# Altium schematic sheet Clock_WR.SchDoc
size A3; DocumentNumber: 24; SheetNumber: 24; SheetTotal: 30
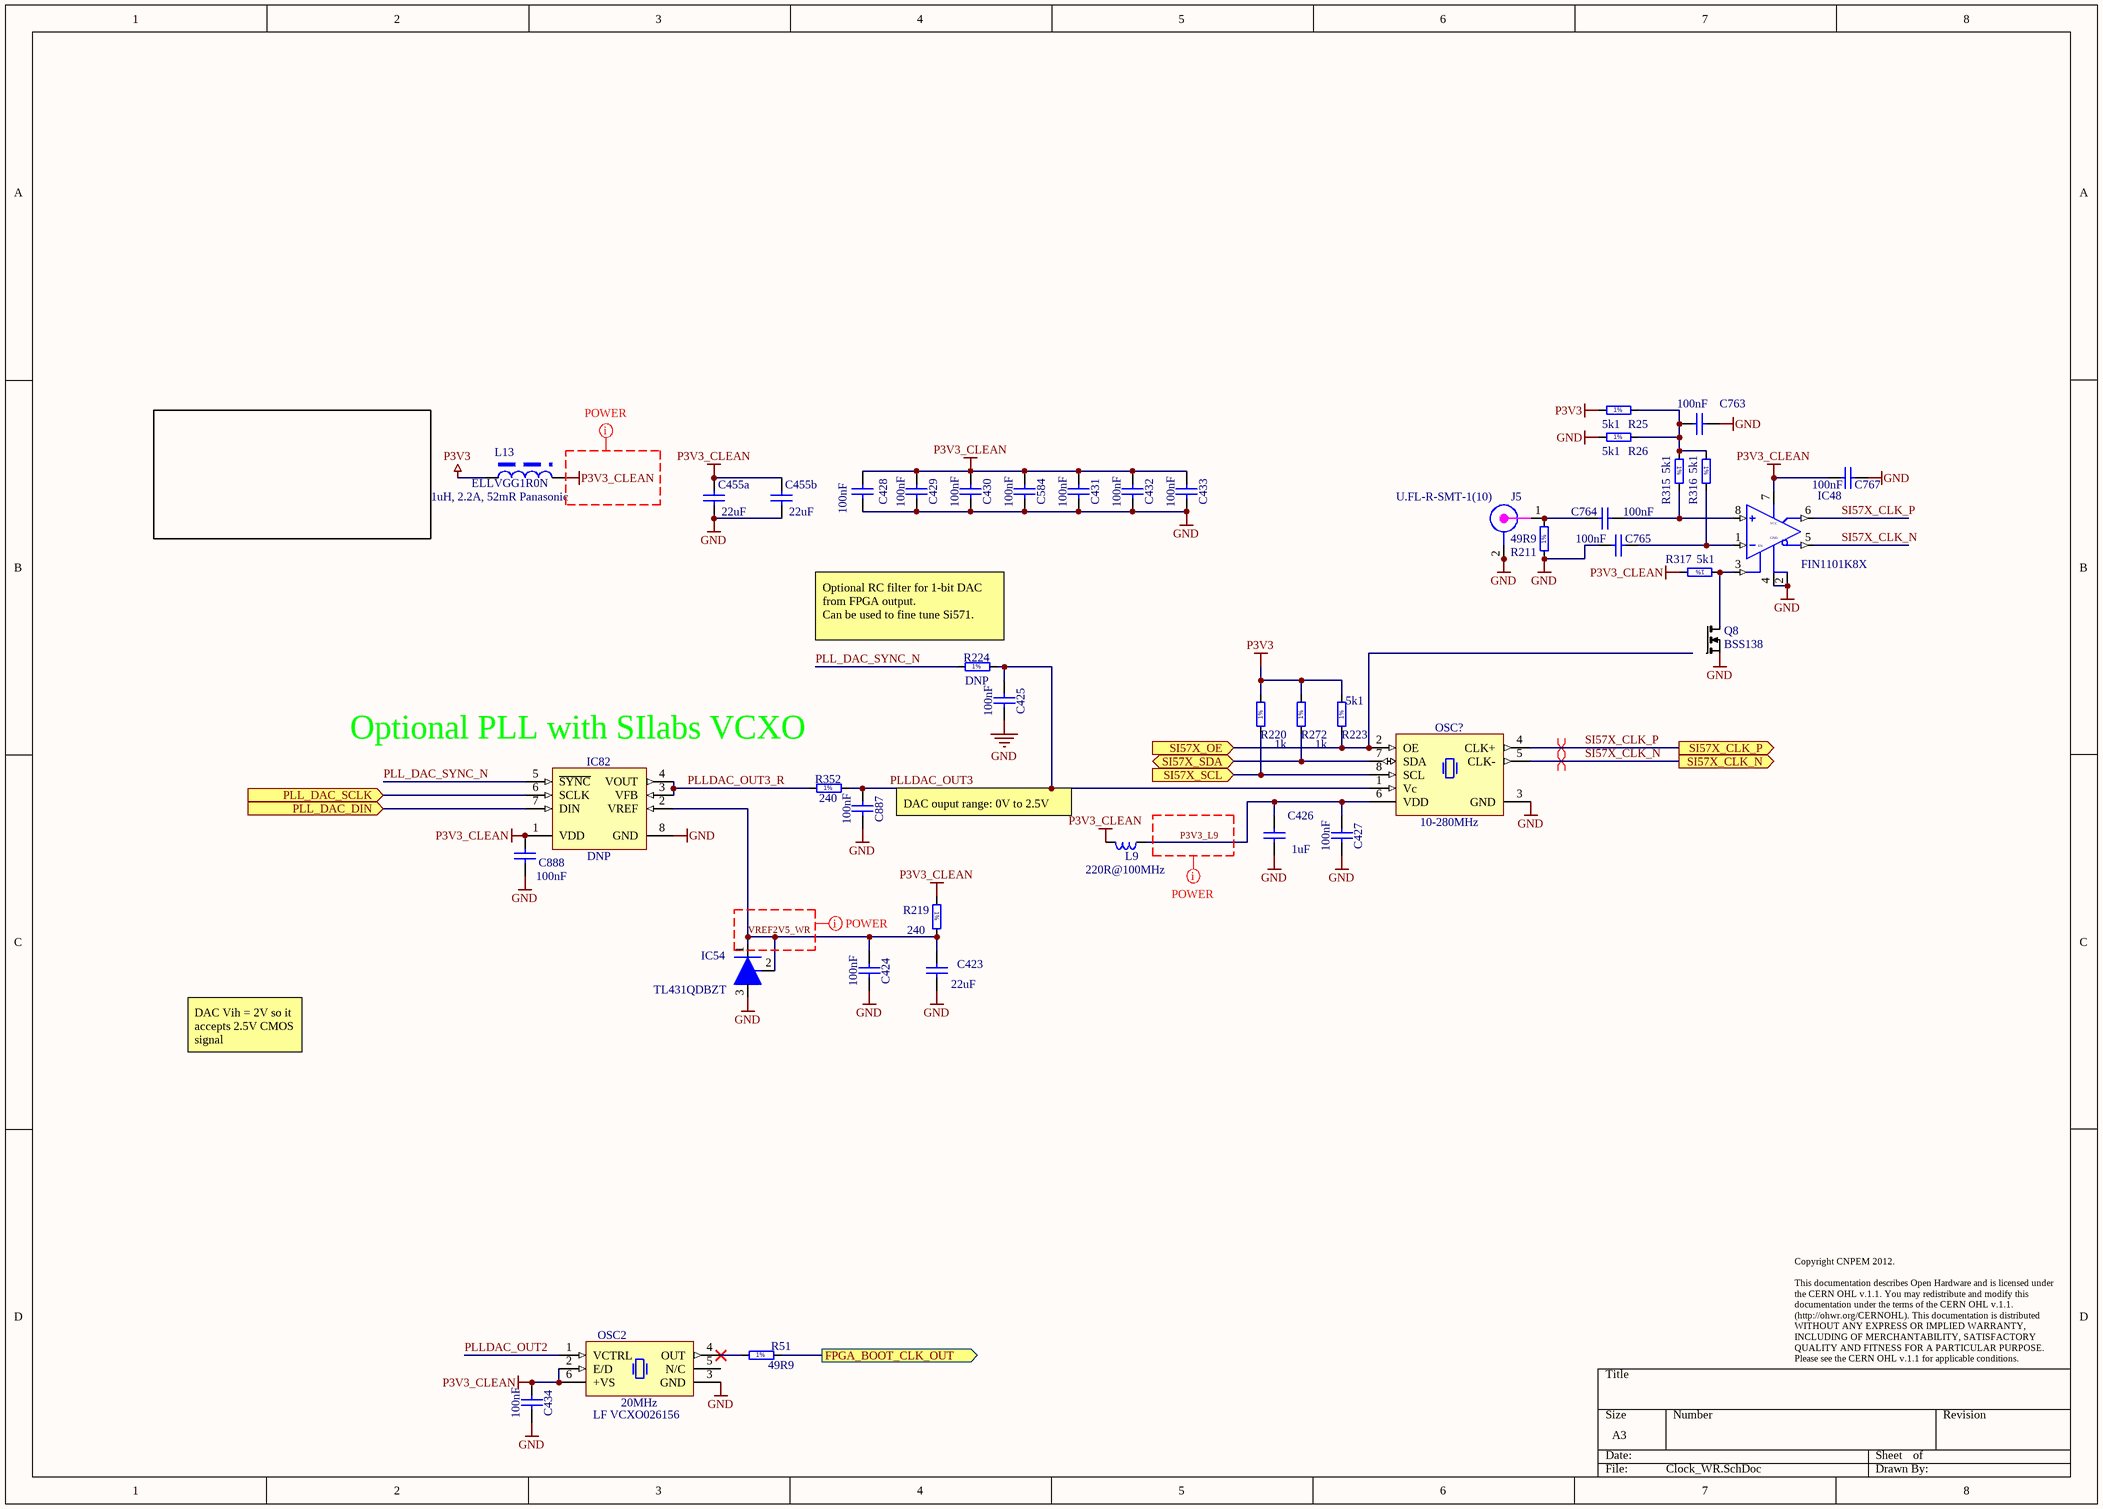
[diagram p0: Clock_WR.SchDoc]

## Parts
C423  22uF  [CAPC3216X180N]
C424  100nF  [CAPC0603X33N]
C425  100nF  [CAPC0603X33N]
C426  1uF  [CAPC1608X87N]
C427  100nF  [CAPC0603X33N]
C428  100nF  [CAPC0603X33N]
C429  100nF  [CAPC0603X33N]
C430  100nF  [CAPC0603X33N]
C431  100nF  [CAPC0603X33N]
C432  100nF  [CAPC0603X33N]
C433  100nF  [CAPC0603X33N]
C434  100nF  [CAPC0603X33N]
C455a  22uF  [CAPC3216X180N]
C455b  22uF  [CAPC3216X180N]
C584  100nF  [CAPC0603X33N]
C763  100nF  [CAPC0603X33N]
C764  100nF  [CAPC0603X33N]
C765  100nF  [CAPC0603X33N]
C767  100nF  [CAPC0603X33N]
C887  100nF  [CAPC0603X33N]
C888  100nF  [CAPC0603X33N]
IC48  FIN1101K8X  [US8]
IC54  TL431QDBZT  [SOT-23]
IC82  DNP  [SOP65P490X110-8N]
J5  U.FL-R-SMT-1(10)  [CON_UFL_HIROSE_RECEPTACLE]
L9  220R@100MHz  [INDC2012X105N]
L13  ELLVGG1R0N  [L_ELLVGG2R2N]
OSC2  20MHz  Manufacturer Part Number: LF VCXO026156  [OSC_IQD_CFPV-45]
OSC?  10-280MHz  [OSC_SILICON-LAB_SI571]
Q8  BSS138  [SOT95P251X112-3N]
R25  5k1  [RESC1608X55N]
R26  5k1  [RESC1608X55N]
R51  49R9  [RESC1005X40N]
R211  49R9  [RESC1005X40N]
R219  240  [RESC1005X40N]
R220  1k  [RESC1005X40N]
R223  5k1  [RESC1608X55N]
R224  DNP  [RESC1005X40N]
R272  1k  [RESC1005X40N]
R315  5k1  [RESC1608X55N]
R316  5k1  [RESC1608X55N]
R317  5k1  [RESC1608X55N]
R352  240  [RESC1005X40N]

## Ports
FPGA_BOOT_CLK_OUT (out), PLL_DAC_DIN (in), PLL_DAC_SCLK (in), SI57X_CLK_N (out), SI57X_CLK_P (out), SI57X_OE (in), SI57X_SCL (in), SI57X_SDA (bidir)

## Nets
GND: C423.1 C424.2 C425.2 C426.1 C427.2 C428.1 C429.2 C430.2 C431.2 C432.2 C433.2 C434.2 C455a.1 C455b.1 C584.2 C763.2 C765.1 C767.2 C887.2 C888.1 IC48.2(GND) IC48.4(GND) IC54.3(A) IC82.8(GND) J5.2 J5.2a(GND) OSC2.3(GND) OSC?.3(GND) Q8.2(S) R26.1 R211.1
P3V3: L13.1 R25.1 R220.2 R223.2 R272.2
P3V3_CLEAN: C428.2 C429.1 C430.1 C431.1 C432.1 C433.1 C434.1 C455a.2 C455b.2 C584.1 C767.1 C888.2 IC48.7(VCC) IC82.1(VDD) L9.2 L13.2 OSC2.2(E/D) OSC2.6(+VS) R219.1 R317.2
FPGA_BOOT_CLK_OUT: R51.2 ; port FPGA_BOOT_CLK_OUT
P3V3_L9: C426.2 C427.1 L9.1 OSC?.6(VDD)
PLL_DAC_DIN: IC82.7(DIN) ; port PLL_DAC_DIN
PLL_DAC_SCLK: IC82.6(SCLK) ; port PLL_DAC_SCLK
PLL_DAC_SYNC_N: IC82.5(~{SYNC}) R224.1
PLLDAC_OUT2: OSC2.1(VCTRL)
PLLDAC_OUT3: C425.1 C887.1 OSC?.1(Vc) R224.2 R352.2
PLLDAC_OUT3_R: IC82.3(VFB) IC82.4(VOUT) R352.1
SI57X_CLK_N: IC48.5(~{Q}) OSC?.5(CLK-) ; port SI57X_CLK_N
SI57X_CLK_P: IC48.6(Q) OSC?.4(CLK+) ; port SI57X_CLK_P
SI57X_OE: OSC?.2(OE) R223.1 ; port SI57X_OE
SI57X_SCL: OSC?.8(SCL) R220.1 ; port SI57X_SCL
SI57X_SDA: OSC?.7(SDA) R272.1 ; port SI57X_SDA
VREF2V5_WR: C423.2 C424.1 IC54.1(I/O) IC54.2(REF) IC82.2(VREF) R219.2
NetC763_1: C763.1 R25.2 R26.2 R315.1 R316.1
NetC764_1: C764.1 IC48.8(IN) R315.2
NetC764_2: C764.2 J5.1 R211.2
NetC765_2: C765.2 IC48.1(IN) R316.2
NetIC48_3: IC48.3(EN) Q8.3(D) R317.1
NetOSC2_4: OSC2.4(OUT) R51.1

Not connected (* = marked no-connect by the designer): OSC2 5(N/C); Q8 1(G)

## Layout directives
differential pair: SI57X_CLK_N, SI57X_CLK_P
net class POWER: P3V3_CLEAN, P3V3_L9, VREF2V5_WR

## Notes on the sheet
- (near R224) Optional RC filter for 1-bit DAC from FPGA output.
  Can be used to fine tune Si571.
- Optional PLL with SIlabs VCXO
- DAC ouput range: 0V to 2.5V
- DAC Vih = 2V so it accepts 2.5V CMOS signal
- Copyright CNPEM 2012.
  This documentation describes Open Hardware and is licensed under the CERN OHL v.1.1. You may redistribute and modify this documentation under the terms of the CERN OHL v.1.1. (http://ohwr.org/CERNOHL). This documentation is distributed WITHOUT ANY EXPRESS OR IMPLIED WARRANTY, INCLUDING OF MERCHANTABILITY, SATISFACTORY QUALITY AND FITNESS FOR A PARTICULAR PURPOSE. Please see the CERN OHL v.1.1 for applicable conditions.
- (in symbol L_CHOKE_ELLVGG) 1uH, 2.2A, 52mR Panasonic
- (in symbol R0402_1K_1%_0.0625W_100PPM) 1%
- (in symbol R0402_49R9_1%_0.0625W_100PPM) 1%
- (in symbol R0402_100R_1%_0.0625W_100PPM) 1%
- (in symbol R0402_240R_1%_0.0625W_100PPM) 1%
- (in symbol R0603_5K1_1%_0.1W_100PPM) 1%

## Library data of the parts
C423 C455a C455b = CC1206_22UF_10V_10%_X7R: Non-polarised capacitor; Part Description: SMD Multilayer Chip Ceramic Capacitor; Manufacturer: GENERIC; Manufacturer1 Part Number: GRM31CR71A226KE15L; Voltage: 10V; TC: X7R; Tolerance: ±10%; Table: Capacitors SMD; Part Number: CC1206_22UF_10V_10%_X7R; Component Kind: Standard; Component Type: Standard; Pin Count: 2; Value: 22uF; Status: Preferred; Manufacturer Part Number: CC1206_22UF_10V_10%_X7R; Case: 1206; Mounted: Yes; Socket: No; SMD: Yes; Manufacturer1 Example: MURATA; Manufacturer1 ComponentHeight: 1.8mm; HelpURL: \\cern.ch\dfs\Applications\Altium\Datasheets\CC1206_X7R_MURATA_GRM-HI-CAP.pdf; Author: CERN DEM JLC; CreateDate: 2010-06-08; LatestRevisionDate: 2010-06-08
C424 C425 C427-C434 C584 C763-C765 C767 C887 C888 = CC0201_100NF_6.3V_10%_X5R: Non-polarised capacitor; Part Description: SMD Multilayer Chip Ceramic Capacitor; Manufacturer: GENERIC; Manufacturer1 Part Number: 02016D104KAT2A; Voltage: 6.3V; TC: X5R; Tolerance: ±10%; Table: Capacitors SMD; Part Number: CC0201_100NF_6.3V_10%_X5R; Component Kind: Standard; Component Type: Standard; Pin Count: 2; Value: 100nF; Status: Not Recommended; Manufacturer Part Number: CC0201_100NF_6.3V_10%_X5R; Case: 0201; Mounted: Yes; Socket: No; SMD: Yes; Manufacturer1 Example: AVX; Manufacturer1 ComponentHeight: 0.33mm; HelpURL: \\cern.ch\dfs\Applications\Altium\Datasheets\CC0201_X5R_AVX.pdf; Author: CERN DEM JLC; CreateDate: 2007-12-03; LatestRevisionDate: 2007-12-03
C426 = CC0603_1UF_16V_10%_X7R: Non-polarised capacitor; Part Description: SMD Multilayer Chip Ceramic Capacitor; Manufacturer: GENERIC; Manufacturer1 Part Number: 223824613663; Voltage: 16V; TC: X7R; Tolerance: ±10%; Table: Capacitors SMD; Part Number: CC0603_1UF_16V_10%_X7R; Component Kind: Standard; Component Type: Standard; Pin Count: 2; Value: 1uF; Status: Preferred; Manufacturer Part Number: CC0603_1uF_16V_10%_X7R; Case: 0603; Mounted: Yes; Socket: No; SMD: Yes; Manufacturer1 Example: PHYCOMP; Manufacturer1 ComponentHeight: 0.87mm; HelpURL: \\cern.ch\dfs\Applications\Altium\Datasheets\CC0805_X5R_PHYCOMP_HC.pdf; Author: CERN DEM JLC; CreateDate: 03/12/2007; LatestRevisionDate: 03/12/2007
IC48 = IFC_FIN1101K8X: LVDS TO LVDS repeater3.3V
IC54 = REF_TL431_SOT23: 2.5V ADJ Voltage reference
IC82 = AD5662BRMZ-1: 2.7V to 5.5V, 250uA, Rail-to-Rail Output 16-Bit nanoDAC; Manufacturer: ANALOG DEVICES; Table: Analog & Interface; Part Number: AD5662BRMZ-1; Component Kind: Standard; Component Type: Standard; Device: AD5662BRMZ-1; PackageDescription: SOP, 8-Leads, Body 3.0x3.0mm, Pitch 0.65mm, IPC Medium Density; Part Description: 2.7V to 5.5V, 250uA, Rail-to-Rail Output 16-Bit nanoDAC; Manufacturer Part Number: AD5662BRMZ-1; Pin Count: 8; Case: MSOP8; Mounted: Yes; Socket: No; SMD: Yes; ComponentHeight: 1.1mm; Author: CERN DEM JLC; HelpURL: \\cern.ch\dfs\Applications\Altium\Datasheets\AD5662BRMZ-1.pdf; CreateDate: 1/10/2011; LatestRevisionDate: 1/10/2011
J5 = CON_UFL_SMD: UFL; Supplier 1: Newark; Supplier Part Number 1: 50P8856
L9 = IND0805_MURATA_BLM21PG221SN1D: Inductor; Part Description: SMD EMIFIL Suppression Chip Bead Ferrite; Manufacturer: MURATA; Power: 2A; Resistance: 0.05R; Tolerance: ±25%; Table: Inductors SMD; Part Number: IND0805_MURATA_BLM21PG221SN1D; Component Kind: Standard; Component Type: Standard; Pin Count: 2; Value: 220R@100MHz; Status: None; Manufacturer Part Number: BLM21PG221SN1D; Case: 0805; Mounted: Yes; Socket: No; SMD: Yes; ComponentHeight: 1.05mm; HelpURL: \\cern.ch\dfs\Applications\Altium\Datasheets\IND0402_MURATA_BLM21P.pdf; Author: CERN DEM JLC; CreateDate: 25/01/2010; LatestRevisionDate: 25/01/2010
L13 = L_CHOKE_ELLVGG: 2.2uH, 1.4A, 92mR Panasonic
OSC2 = OSC_20MHZ_IQD_LF VCXO026156: 3.3V ±100ppm 15pF HCMOS Tri-State Surface Mount Voltage Controlled Oscillator VCXO (CFPV-45 Serie); Manufacturer: IQD FREQUENCY PRODUCTS; Table: Crystals & Oscillators; Part Number: OSC_20MHZ_IQD_LF VCXO026156; Component Kind: Standard; Component Type: Standard; PackageDescription: SMD VCXO, side convave, 6 pins, 5.00x7.00mm (CFPV-45 Serie); Value: 20MHz; Part Description: 3.3V ±100ppm 15pF HCMOS Tri-State Surface Mount Voltage Controlled Oscillator VCXO (CFPV-45 Serie); Pin Count: 6; Mounted: Yes; Socket: No; SMD: Yes; ComponentHeight: 1.7mm; HelpURL: \\cern.ch\dfs\Applications\Altium\Datasheets\OSC_IQD_CFPV-45.pdf; Author: CERN DEM JLC; CreateDate: 1/24/2011; LatestRevisionDate: 1/24/2011
OSC? = OSC_10-280MHZ_SILICON-LAB_Si571AJC000337DG: Any-Rate I2C Programmable XO Oscillator Si571 Serie; Part Description: 10-280MHz 3.3V ±20ppm LVPECL, I2C Programmable VCXO Oscillator Si571 Series; Manufacturer: SILICON LABS; PressFit: No; Bonding: No; Part Number: OSC_10-280MHZ_SILICON-LAB_Si571AJC000337DG; Component Kind: Standard; Component Type: Standard; PackageDescription: Oscillator Si571 Series, 8 pins, 5x7mm; Value: 10-280MHz; Manufacturer Part Number: Si571AJC000337DG; Pin Count: 8; Mounted: Yes; Socket: No; SMD: Yes; Sense: No; ComponentHeight: 1.85mm; HelpURL: \\cern.ch\dfs\Applications\Altium\Datasheets\OSC_SILICON-LAB_SI571.pdf; Author: CERN DEM JLC; CreateDate: 07/07/2014; LatestRevisionDate: 07/07/2014
Q8 = Q_BSS138
R25 R26 R223 R315-R317 = R0603_5K1_1%_0.1W_100PPM: Resistor - 1%; Part Description: General Purpose Thick Film Chip Resistor; Manufacturer: GENERIC; Manufacturer1 Part Number: NRC06F5101TRF; Power: 0.1W; TC: ±100ppm/°C; Table: Resistors SMD; Part Number: R0603_5K1_1%_0.1W_100PPM; Component Kind: Standard; Component Type: Standard; Pin Count: 2; Value: 5k1; Status: Preferred; Tolerance: ±1%; Manufacturer Part Number: R0603_5K1_1%_0.1W_100PPM; Case: 0603; Mounted: Yes; Socket: No; SMD: Yes; Manufacturer1 Example: NIC COMPONENT; Manufacturer1 ComponentHeight: 0.55mm; HelpURL: \\cern.ch\dfs\Applications\Altium\Datasheets\R0603_NIC_NRC.pdf; Author: CERN DEM JLC; CreateDate: 03/12/2007; LatestRevisionDate: 13/03/2008
R51 R211 = R0402_49R9_1%_0.0625W_100PPM: Resistor - 1%; Part Description: General Purpose Thick Film Chip Resistor; Manufacturer: GENERIC; Manufacturer1 Part Number: 232270674999L or RC0402FR-0749R9L; TC: ±100ppm/°C; Table: Resistors SMD; Part Number: R0402_49R9_1%_0.0625W_100PPM; Component Kind: Standard; Component Type: Standard; Pin Count: 2; Value: 49R9; Status: Not recommended; Power: 0.0625W; Tolerance: ±1%; Manufacturer Part Number: R0402_49R9_1%_0.0625W_100PPM; Case: 0402; Mounted: Yes; Socket: No; SMD: Yes; Manufacturer1 Example: YAGEO PHYCOMP; Manufacturer1 ComponentHeight: 0.4mm; HelpURL: \\cern.ch\dfs\Applications\Altium\Datasheets\R0402_Phycomp_RC0402.pdf; Author: CERN DEM JLC; CreateDate: 2012-10-24; LatestRevisionDate: 2012-10-24
R219 R352 = R0402_240R_1%_0.0625W_100PPM: Resistor - 1%; Part Description: General Purpose Thick Film Chip Resistor; Manufacturer: GENERIC; Manufacturer1 Part Number: 232270672401L; TC: ±100ppm/°C; Table: Resistors SMD; Part Number: R0402_240R_1%_0.0625W_100PPM; Component Kind: Standard; Component Type: Standard; Pin Count: 2; Value: 240; Status: Not recommended; Power: 0.0625W; Tolerance: ±1%; Manufacturer Part Number: R0402_240R_1%_0.0625W_100PPM; Case: 0402; Mounted: Yes; Socket: No; SMD: Yes; Manufacturer1 Example: YAGEO PHYCOMP; Manufacturer1 ComponentHeight: 0.4mm; HelpURL: \\cern.ch\dfs\Applications\Altium\Datasheets\R0402_Phycomp_RC0402.pdf; Author: CERN DEM JLC; CreateDate: 2007-12-03; LatestRevisionDate: 2012-10-17
R220 R272 = R0402_1K_1%_0.0625W_100PPM: Resistor - 1%; Part Description: General Purpose Thick Film Chip Resistor; Manufacturer: GENERIC; Manufacturer1 Part Number: 232270671002L; TC: ±100ppm/°C; Table: Resistors SMD; Part Number: R0402_1K_1%_0.0625W_100PPM; Component Kind: Standard; Component Type: Standard; Pin Count: 2; Value: 1k; Status: Not recommended; Power: 0.0625W; Tolerance: ±1%; Manufacturer Part Number: R0402_1K_1%_0.0625W_100PPM; Case: 0402; Mounted: Yes; Socket: No; SMD: Yes; Manufacturer1 Example: YAGEO PHYCOMP; Manufacturer1 ComponentHeight: 0.4mm; HelpURL: \\cern.ch\dfs\Applications\Altium\Datasheets\R0402_Phycomp_RC0402.pdf; Author: CERN DEM JLC; CreateDate: 2007-12-03; LatestRevisionDate: 2012-10-17
R224 = R0402_100R_1%_0.0625W_100PPM: Resistor - 1%; Part Description: General Purpose Thick Film Chip Resistor; Manufacturer: GENERIC; Manufacturer1 Part Number: 232270671001L; Value: 100; TC: ±100ppm/°C; Table: Resistors SMD; Part Number: R0402_100R_1%_0.0625W_100PPM; Component Kind: Standard; Component Type: Standard; Pin Count: 2; Status: Not recommended; Power: 0.0625W; Tolerance: ±1%; Manufacturer Part Number: R0402_100R_1%_0.0625W_100PPM; Case: 0402; Mounted: Yes; Socket: No; SMD: Yes; Manufacturer1 Example: YAGEO PHYCOMP; Manufacturer1 ComponentHeight: 0.4mm; HelpURL: \\cern.ch\dfs\Applications\Altium\Datasheets\R0402_Phycomp_RC0402.pdf; Author: CERN DEM JLC; CreateDate: 2007-12-03; LatestRevisionDate: 2012-10-17